# Altium schematic sheet processingModule.SchDoc
size C; SheetNumber: 1; SheetTotal: 1
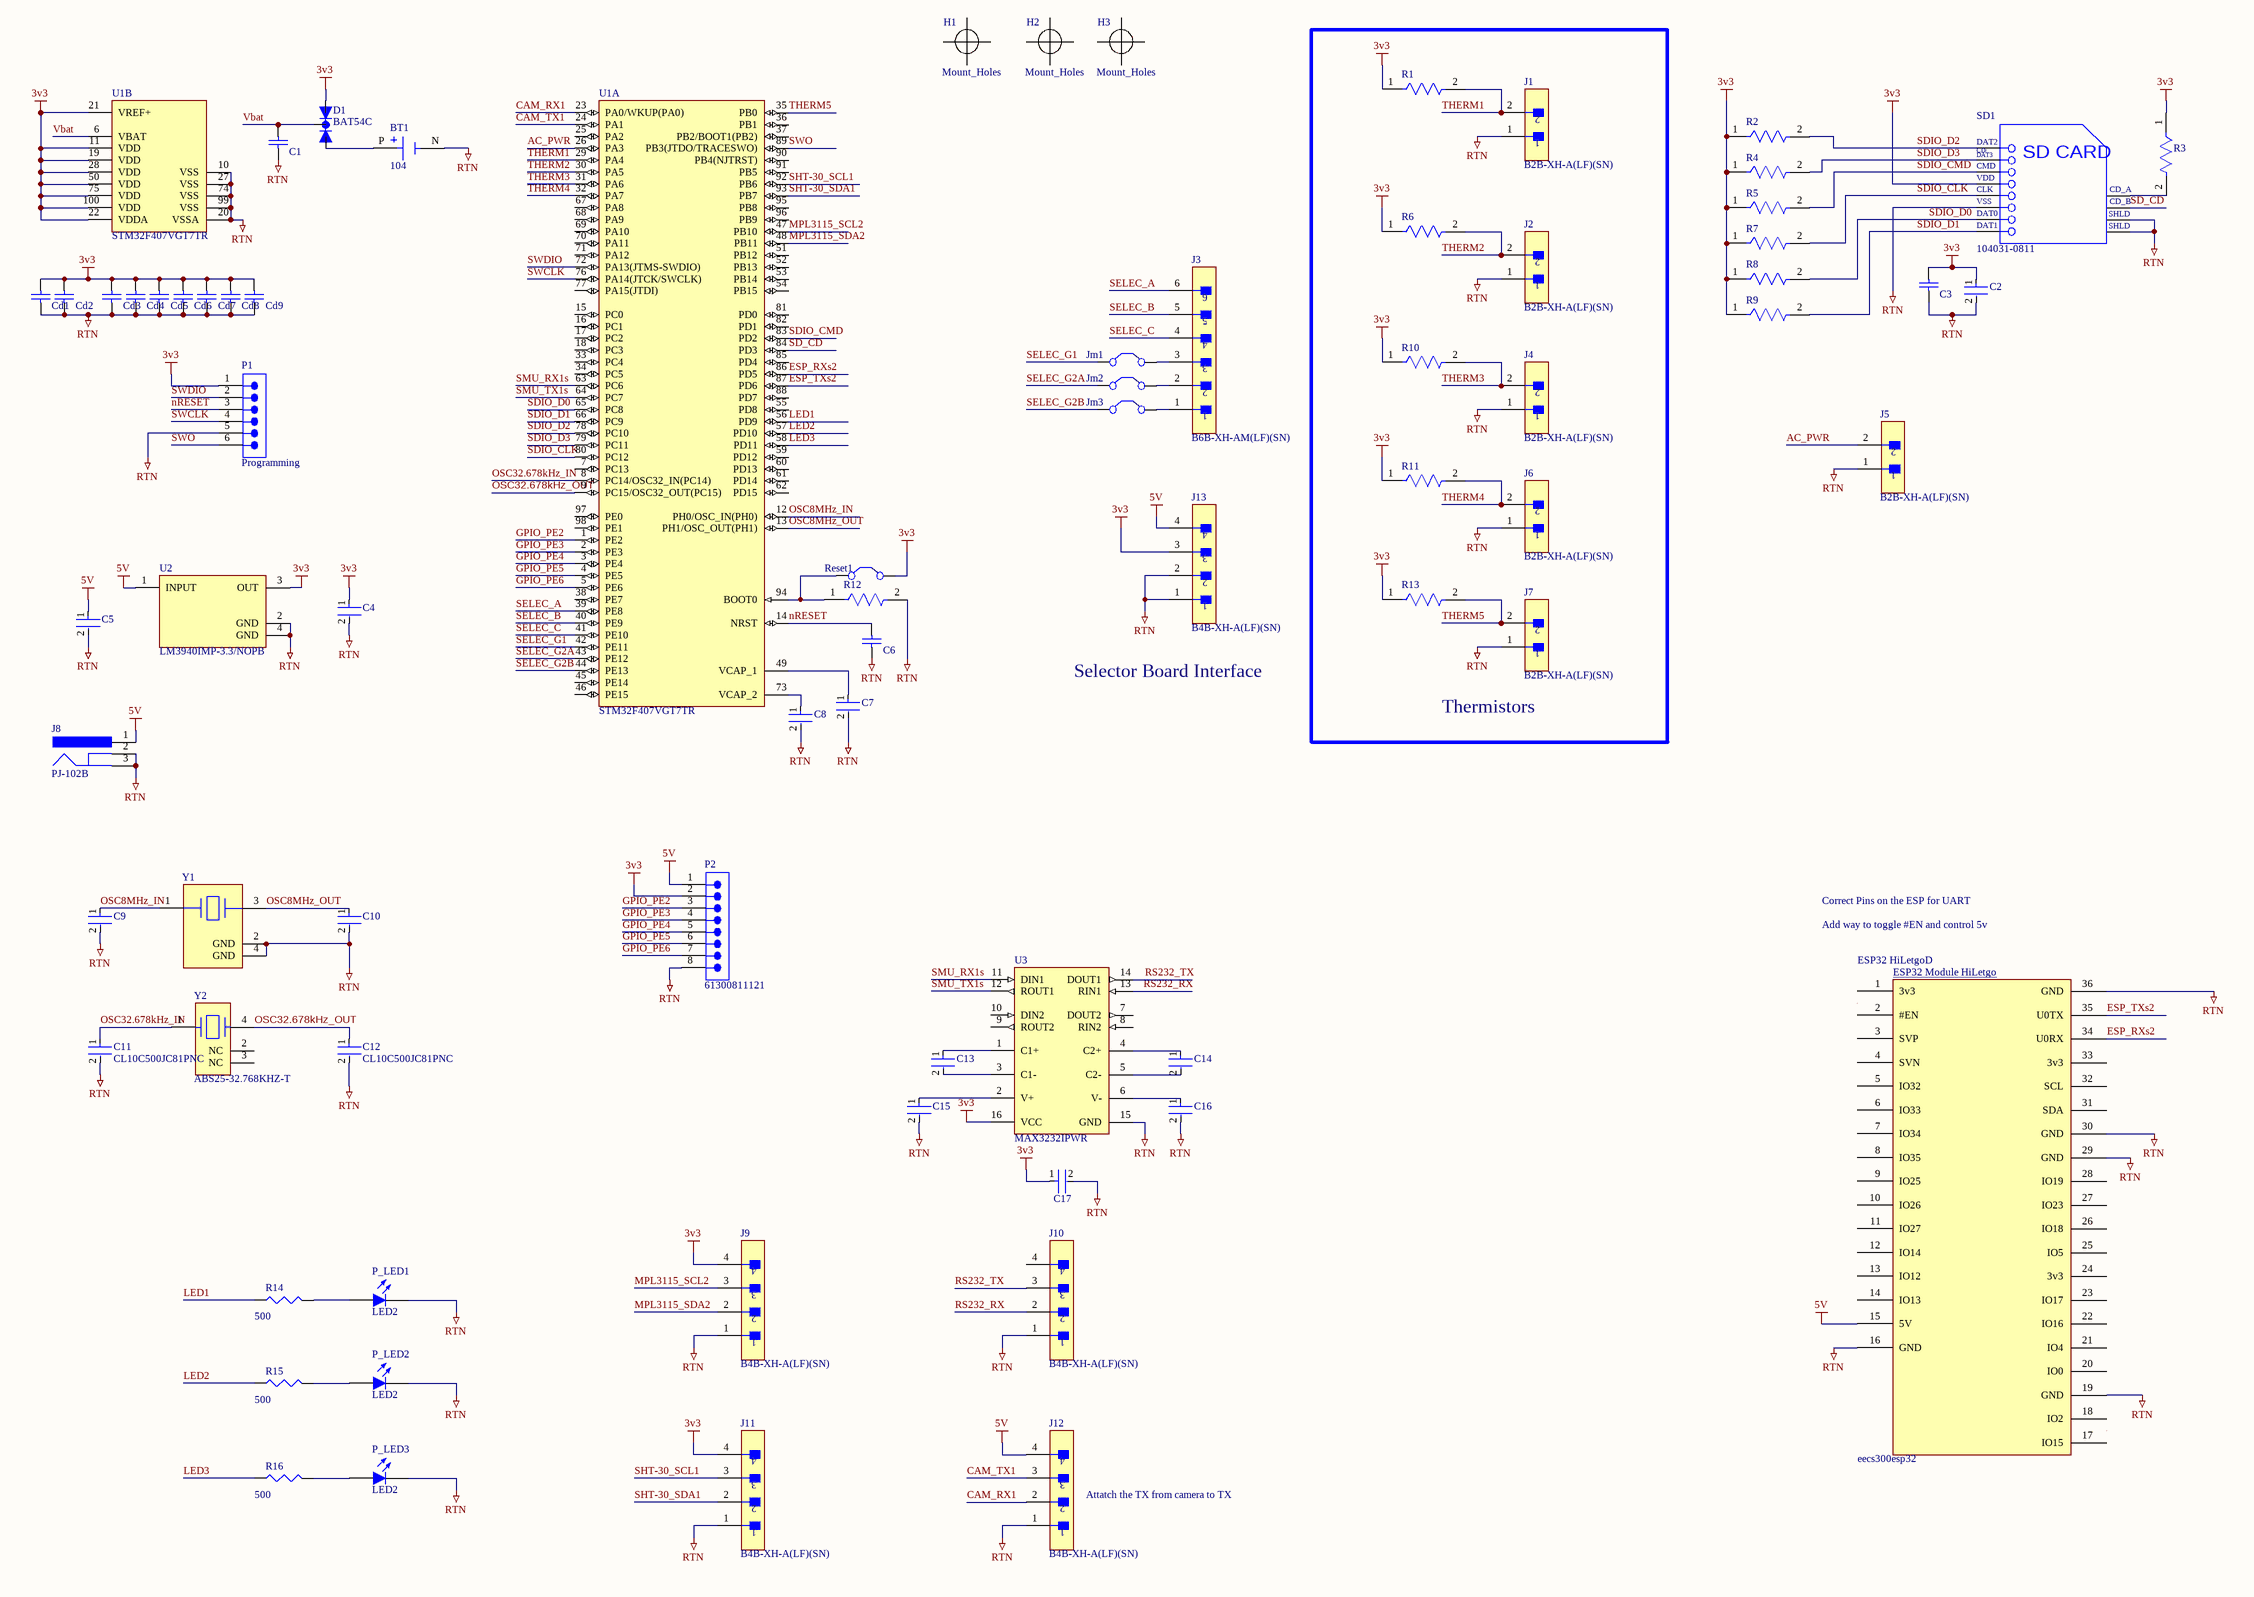
[diagram p0: processingModule.SchDoc]

## Parts
BT1  104  [BAT_104]
C1  CAP 10uF 10V 0603(1608)  [CAPC0603(1608)100_N]  (value not drawn)
C2  C0603X104K5RACTU  [FP-C0603-CJ-MFG]  (value not drawn)
C3  CAP 10uF 10V 0603(1608)  [CAPC0603(1608)100_N]  (value not drawn)
C4  C2012X5R1A336M125AC  [FP-C2012-125-0_2-IPC_A]  (value not drawn)
C5  GRM188R71C474KA88D  [FP-GRM188-0_1-e0_2_0_5-IPC_A]  (value not drawn)
C6  CAP 100nF 16V 0603(1608)  [CAPC0603(1608)100_N]  (value not drawn)
C7  C0603C225K4PACTU  [FP-C0603C225K4PACTU-MFG]  (value not drawn)
C8  C0603C225K4PACTU  [FP-C0603C225K4PACTU-MFG]  (value not drawn)
C9  C0603C200J5GACTU  [FP-C0603C-CF-MFG]  (value not drawn)
C10  C0603C200J5GACTU  [FP-C0603C-CF-MFG]  (value not drawn)
C11  CL10C500JC81PNC  [FP-CL10-IPC_B]
C12  CL10C500JC81PNC  [FP-CL10-IPC_B]
C13  C0603X104K5RACTU  [FP-C0603-CJ-MFG]  (value not drawn)
C14  C0603X104K5RACTU  [FP-C0603-CJ-MFG]  (value not drawn)
C15  C0603X104K5RACTU  [FP-C0603-CJ-MFG]  (value not drawn)
C16  C0603X104K5RACTU  [FP-C0603-CJ-MFG]  (value not drawn)
C17  C0603X104K5RACTU  [FP-C0603-CJ-MFG]  (value not drawn)
Cd1  CAP 10uF 10V 0603(1608)  [CAPC0603(1608)100_N]  (value not drawn)
Cd2  CAP 10uF 10V 0603(1608)  [CAPC0603(1608)100_N]  (value not drawn)
Cd3  CAP 100nF 16V 0603(1608)  [CAPC0603(1608)100_N]  (value not drawn)
Cd4  CAP 100nF 16V 0603(1608)  [CAPC0603(1608)100_N]  (value not drawn)
Cd5  CAP 100nF 16V 0603(1608)  [CAPC0603(1608)100_N]  (value not drawn)
Cd6  CAP 100nF 16V 0603(1608)  [CAPC0603(1608)100_N]  (value not drawn)
Cd7  CAP 100nF 16V 0603(1608)  [CAPC0603(1608)100_N]  (value not drawn)
Cd8  CAP 100nF 16V 0603(1608)  [CAPC0603(1608)100_N]  (value not drawn)
Cd9  CAP 100nF 16V 0603(1608)  [CAPC0603(1608)100_N]  (value not drawn)
D1  BAT54C  [SOT23-R]
ESP32_HiLetgo  eecs300esp32  [eecs300esp32-Footprint-1]  (part D of 4)
H1  Mount_Holes  [MountHole-4-40PTH]
H2  Mount_Holes  [MountHole-4-40PTH]
H3  Mount_Holes  [MountHole-4-40PTH]
J1  B2B-XH-A(LF)(SN)  [FP-B2B-XH-A_LF_SN-MFG]
J2  B2B-XH-A(LF)(SN)  [FP-B2B-XH-A_LF_SN-MFG]
J3  B6B-XH-AM(LF)(SN)  [FP-B6B-XH-AM_LF_SN-MFG]
J4  B2B-XH-A(LF)(SN)  [FP-B2B-XH-A_LF_SN-MFG]
J5  B2B-XH-A(LF)(SN)  [FP-B2B-XH-A_LF_SN-MFG]
J6  B2B-XH-A(LF)(SN)  [FP-B2B-XH-A_LF_SN-MFG]
J7  B2B-XH-A(LF)(SN)  [FP-B2B-XH-A_LF_SN-MFG]
J8  PJ-102B  [CUI-PJ-102B_V]
J9  B4B-XH-A(LF)(SN)  [FP-B4B-XH-A_LF_SN-MFG]
J10  B4B-XH-A(LF)(SN)  [FP-B4B-XH-A_LF_SN-MFG]
J11  B4B-XH-A(LF)(SN)  [FP-B4B-XH-A_LF_SN-MFG]
J12  B4B-XH-A(LF)(SN)  [FP-B4B-XH-A_LF_SN-MFG]
J13  B4B-XH-A(LF)(SN)  [FP-B4B-XH-A_LF_SN-MFG]
Jm1  SolderJumper  [bridge]  (value not drawn)
Jm2  SolderJumper  [bridge]  (value not drawn)
Jm3  SolderJumper  [bridge]  (value not drawn)
P1  Programming  [61300611121]
P2  61300811121  [61300811121]
P_LED1  LED2  [LED0805]
P_LED2  LED2  [LED0805]
P_LED3  LED2  [LED0805]
R1  RC0603FR-0710KL  [FP-RC0603-0_55-IPC_C]  (value not drawn)
R2  RC0603FR-0747KL  [FP-RC0603FR-0747KL-MFG]  (value not drawn)
R3  RC0603FR-0747KL  [FP-RC0603FR-0747KL-MFG]  (value not drawn)
R4  RC0603FR-0747KL  [FP-RC0603FR-0747KL-MFG]  (value not drawn)
R5  RC0603FR-0747KL  [FP-RC0603FR-0747KL-MFG]  (value not drawn)
R6  RC0603FR-0710KL  [FP-RC0603-0_55-IPC_C]  (value not drawn)
R7  RC0603FR-0747KL  [FP-RC0603FR-0747KL-MFG]  (value not drawn)
R8  RC0603FR-0747KL  [FP-RC0603FR-0747KL-MFG]  (value not drawn)
R9  RC0603FR-0747KL  [FP-RC0603FR-0747KL-MFG]  (value not drawn)
R10  RC0603FR-0710KL  [FP-RC0603-0_55-IPC_C]  (value not drawn)
R11  RC0603FR-0710KL  [FP-RC0603-0_55-IPC_C]  (value not drawn)
R12  RC0603FR-0710KL  [FP-RC0603-0_55-IPC_C]  (value not drawn)
R13  RC0603FR-0710KL  [FP-RC0603-0_55-IPC_C]  (value not drawn)
R14  500  [J1-0603]
R15  500  [J1-0603]
R16  500  [J1-0603]
Reset1  SolderJumper  [bridge]  (value not drawn)
SD1  104031-0811  [MOLX-104031-0811_V]
U1  STM32F407VGT7TR  [STM-LQFP100_L]  (parts A,B of 2)
U2  LM3940IMP-3.3/NOPB  [FP-DCY0004A-MFG]
U3  MAX3232IPWR  [PW0016A_N]
Y1  ABM3B-8.000MHZ-10-D-1-G-T  [FP-ABM3B-MFG]  (value not drawn)
Y2  ABS25-32.768KHZ-T  [FP-ABS25-MFG]

## Blocks framed on the sheet
Thermistors: J1 J2 J4 J6 J7 R1 R6 R10 R11 R13

## Nets
3v3: C2.1 C3.2 C4.1 C17.1 Cd1.2 Cd2.2 Cd3.2 Cd4.2 Cd5.2 Cd6.2 Cd7.2 Cd8.2 Cd9.2 D1.2(A2) J9.4 J11.4 J13.3 P1.1 P2.2 R1.1 R2.1 R3.1 R4.1 R5.1 R6.1 R7.1 R8.1 R9.1 R10.1 R11.1 R13.1 Reset1.2(C2) SD1.4(VDD) U1.11(VDD) U1.19(VDD) U1.21(VREF+) U1.22(VDDA) U1.28(VDD) U1.50(VDD) U1.75(VDD) U1.100(VDD) U2.3(OUT) U3.16(VCC)
5V: C5.1 ESP32_HiLetgo.15(5V) J8.1 J12.4 J13.4 P2.1 U2.1(INPUT)
RTN: BT1.N(NEG) C1.1 C2.2 C3.1 C4.2 C5.2 C6.1 C7.2 C8.2 C9.2 C10.2 C11.2 C12.2 C15.2 C16.2 C17.2 Cd1.1 Cd2.1 Cd3.1 Cd4.1 Cd5.1 Cd6.1 Cd7.1 Cd8.1 Cd9.1 ESP32_HiLetgo.16(GND) ESP32_HiLetgo.19(GND) ESP32_HiLetgo.29(GND) ESP32_HiLetgo.30(GND) ESP32_HiLetgo.36(GND) J1.1 J2.1 J4.1 J5.1 J6.1 J7.1 J8.2 J8.3 J9.1 J10.1 J11.1 J12.1 J13.1 J13.2 P1.5 P2.8 P_LED1.2(K) P_LED2.2(K) P_LED3.2(K) R12.2 SD1.6(VSS2) SD1.11(SHLD1) SD1.12(SHLD2) U1.10(VSS) U1.20(VSSA) U1.27(VSS) U1.74(VSS) U1.99(VSS) U2.2(GND) U2.4(GND) U3.15(GND) Y1.2(GND) Y1.4(GND)
AC_PWR: J5.2 U1.26(PA3)
CAM_RX1: J12.2 U1.23(PA0/WKUP(PA0))
CAM_TX1: J12.3 U1.24(PA1)
ESP_RXs2: ESP32_HiLetgo.34(U0RX) U1.86(PD5)
ESP_TXs2: ESP32_HiLetgo.35(U0TX) U1.87(PD6)
GPIO_PE2: P2.3 U1.1(PE2)
GPIO_PE3: P2.4 U1.2(PE3)
GPIO_PE4: P2.5 U1.3(PE4)
GPIO_PE5: P2.6 U1.4(PE5)
GPIO_PE6: P2.7 U1.5(PE6)
LED1: R14.1 U1.56(PD9)
LED2: R15.1 U1.57(PD10)
LED3: R16.1 U1.58(PD11)
MPL3115_SCL2: J9.3 U1.47(PB10)
MPL3115_SDA2: J9.2 U1.48(PB11)
nRESET: C6.2 P1.3 U1.14(NRST)
OSC8MHz_IN: C9.1 U1.12(PH0/OSC_IN(PH0)) Y1.1
OSC8MHz_OUT: C10.1 U1.13(PH1/OSC_OUT(PH1)) Y1.3
OSC32.678kHz_IN: C11.1 U1.8(PC14/OSC32_IN(PC14)) Y2.1
OSC32.678kHz_OUT: C12.1 U1.9(PC15/OSC32_OUT(PC15)) Y2.4
RS232_RX: J10.2 U3.13(RIN1)
RS232_TX: J10.3 U3.14(DOUT1)
SD_CD: SD1.10(CD_B) U1.84(PD3)
SDIO_CLK: R7.2 SD1.5(CLK) U1.80(PC12)
SDIO_CMD: R5.2 SD1.3(VSS1) U1.83(PD2)
SDIO_D0: R8.2 SD1.7(DAT0) U1.65(PC8)
SDIO_D1: R9.2 SD1.8(DAT1) U1.66(PC9)
SDIO_D2: R2.2 SD1.1(CD/DAT3) U1.78(PC10)
SDIO_D3: R4.2 SD1.2(CMD) U1.79(PC11)
SELEC_A: J3.6 U1.39(PE8)
SELEC_B: J3.5 U1.40(PE9)
SELEC_C: J3.4 U1.41(PE10)
SELEC_G1: Jm1.1(C1) U1.42(PE11)
SELEC_G2A: Jm2.1(C1) U1.43(PE12)
SELEC_G2B: Jm3.1(C1) U1.44(PE13)
SHT-30_SCL1: J11.3 U1.92(PB6)
SHT-30_SDA1: J11.2 U1.93(PB7)
SMU_RX1s: U1.63(PC6) U3.11(DIN1)
SMU_TX1s: U1.64(PC7) U3.12(ROUT1)
SWCLK: P1.4 U1.76(PA14(JTCK/SWCLK))
SWDIO: P1.2 U1.72(PA13(JTMS-SWDIO))
SWO: P1.6 U1.89(PB3(JTDO/TRACESWO))
THERM1: J1.2 R1.2 U1.29(PA4)
THERM2: J2.2 R6.2 U1.30(PA5)
THERM3: J4.2 R10.2 U1.31(PA6)
THERM4: J6.2 R11.2 U1.32(PA7)
THERM5: J7.2 R13.2 U1.35(PB0)
Vbat: C1.2 D1.3(C) U1.6(VBAT)
NetBT1_P: BT1.P(POS) D1.1(A1)
NetC7_1: C7.1 U1.49(VCAP_1)
NetC8_1: C8.1 U1.73(VCAP_2)
NetC13_1: C13.1 U3.1(C1+)
NetC13_2: C13.2 U3.3(C1-)
NetC14_1: C14.1 U3.4(C2+)
NetC14_2: C14.2 U3.5(C2-)
NetC15_1: C15.1 U3.2(V+)
NetC16_1: C16.1 U3.6(V-)
NetJ3_1: J3.1 Jm3.2(C2)
NetJ3_2: J3.2 Jm2.2(C2)
NetJ3_3: J3.3 Jm1.2(C2)
NetP_LED1_1: P_LED1.1(A) R14.2
NetP_LED2_1: P_LED2.1(A) R15.2
NetP_LED3_1: P_LED3.1(A) R16.2
NetR3_2: R3.2 SD1.9(CD_A)
NetR12_1: R12.1 Reset1.1(C1) U1.94(BOOT0)

Not connected (* = marked no-connect by the designer): ESP32_HiLetgo 1(3v3) 2(#EN) 3(SVP) 4(SVN) 5(IO32) 6(IO33) 7(IO34) 8(IO35) 9(IO25) 10(IO26) 11(IO27) 12(IO14) 13(IO12) 14(IO13) 17(IO15) 18(IO2) 20(IO0) 21(IO4) 22(IO16) 23(IO17) 24(3v3) 25(IO5) 26(IO18) 27(IO23) 28(IO19) 31(SDA) 32(SCL) 33(3v3); H1 0; H2 0; H3 0; J10 4; U1 7(PC13) 15(PC0) 16(PC1) 17(PC2) 18(PC3) 25(PA2) 33(PC4) 34(PC5) 36(PB1) 37(PB2/BOOT1(PB2)) 38(PE7) 45(PE14) 46(PE15) 51(PB12) 52(PB13) 53(PB14) 54(PB15) 55(PD8) 59(PD12) 60(PD13) 61(PD14) 62(PD15) 67(PA8) 68(PA9) 69(PA10) 70(PA11) 71(PA12) 77(PA15(JTDI)) 81(PD0) 82(PD1) 85(PD4) 88(PD7) 90(PB4(NJTRST)) 91(PB5) 95(PB8) 96(PB9) 97(PE0) 98(PE1); U3 7(DOUT2) 8(RIN2) 9(ROUT2) 10(DIN2); Y2 2(NC) 3(NC)

## Notes on the sheet
- Selector Board Interface
- Correct Pins on the ESP for UART
- Add way to toggle #EN and control 5v
- (near J12) Attatch the TX from camera to TX
- (in symbol CMP-001-0002-3, part D) ESP32 Module HiLetgo
- (in symbol CMP-2000-05825-1) DAT2; CD/; DAT3; SD CARD; VSS; SHLD

## Library data of the parts
C1 C3 Cd1 Cd2 = CMP-1035-02799-1: CAP 10uF 10V ±10% 0603 (1608 Metric) Thickness 1mm SMD; Case-Metric: 1608; Case-EIA: 0603; Max Thickness: 1 mm; Tolerance: ±10%; Technology: SMT; Rated Voltage: 10 V; Value: 10uF
C2 C13-C17 = CMP-2006-03300-2: CAP CER 0.1UF 50V X7R 0603; Manufacturer: Kemet; Capacitance: 100nF; Material: Ceramic; Tolerance: 10%; Value: 100nF; Temperature Coefficient: 15%; Temperature Range High: +125°C; Temperature Range Low: -55°C; Manufacturer Part Number: C0603X104K5RACTU; Voltage: 50V; ComponentLink2Description: Datasheet; RoHS: TRUE; ComponentLink2URL: https://content.kemet.com/datasheets/KEM_C1013_X7R_FT-CAP_SMD.pdf; Device Class L3: Ceramic Capacitors; Device Class L2: Capacitors; Package: C0603-CJ; Height: 0.95mm; Device Class L1: Passive Components; Temperature Characteristic: X7R; Lead Free: Yes; Digikey Description: CAP CER 0.1UF 50V X7R 0603; Automotive: No; Mouser Description: Capacitor; Ceramic; Cap 0.1uF; Tol+10%; SMT; Flexible Termination; Vol-Rtg 50V; TR; Temperature: -55°C to +125°C; Octopart: https://octopart.com/c0603x104k5ractu-kemet-9145062; Category: Cap; Voltage Rating: 50V; Ipc Land Pattern Name: CAPC16080X80
C4 = CMP-08246-002720-1: Multilayer Ceramic Capacitors 33μF ±20% 10V X5R SMD 0805; Capacitance: 33uF; Dielectric: X5R; Series: C; Packaging: Tape and Reel; Voltage Rating: 10V; Height: 1.25mm; Tolerance: 20%; Thickness: 0.057inch; Min Operating Temperature: -55°C; Max Operating Temperature: 85°C; Case Code (Imperial): 0805; Voltage Rating (DC): 10V; Case Code (Metric): 2012; Length: 2mm; REACH SVHC: No SVHC; Depth: 1.25mm; Package Quantity: 1; Dielectric Material: Ceramic; Lead Free: Lead Free; Case/Package: 0805; Termination: SMD/SMT; Resistor Type: Ceramic; RoHS Compliant: Yes; Width: 0.049inch; Weight: 0.000194oz; Mount: Surface Mount
C5 = CMP-2006-02860-2: Chip Multilayer Ceramic Capacitors for General Purpose, 0603, 0.47uF, X7R, 15%, 10%, 16V; Capacitance: 470nF; Material: Ceramic; Termination: SMD/SMT; Case Code (Imperial): 0603; Height: 0.8mm; Dielectric: X7R; Length: 1.6mm; Packaging: Tape and Reel; Mount: Surface Mount; Thickness: 0.035inch; Voltage Rating (DC): 16V; Case Code (Metric): 1608; REACH SVHC: No SVHC; Depth: 0.8mm; Number of Pins: 2; Max Operating Temperature: 125°C; Min Operating Temperature: -55°C; Width: 0.8mm; Voltage: 16V; Lead Free: Lead Free; Voltage Rating: 16V; Package Quantity: 1; Case/Package: 0603; Tolerance: 10%
C6 Cd3-Cd9 = CMP-1035-02583-1: CAP 100nF 16V ±5% 0603 (1608 Metric) Thickness 1mm SMD; Case-Metric: 1608; Case-EIA: 0603; Tolerance: ±5%; Rated Voltage: 16 V; Max Thickness: 1 mm; Technology: SMT; Value: 100nF
C7 C8 = CMP-2006-02259-2: CAP CER 2.2UF 16V X5R 0603; Dielectric Material: Ceramic; Tolerance: 10%; Dissipation Factor: 5%; Series: C; Voltage Rating (DC): 16V; REACH SVHC: No SVHC; RoHS Compliant: Yes; Number of Pins: 2; Max Operating Temperature: 85°C; Voltage Rating: 16V; Min Operating Temperature: -55°C; Termination: SMD/SMT; Dielectric: X5R; Packaging: Tape and Reel; Contact Plating: Tin; Case Code (Metric): 1608; Height: 0.8mm; Capacitance: 2.2uF; Case/Package: 0603; Width: 0.8mm; Construction: Flat; Depth: 0.8mm; Thickness: 0.034inch; Radiation Hardening: No; Length: 1.6mm; Mount: Surface Mount; Case Code (Imperial): 0603; Voltage: 16V; Package Quantity: 1; Lead Free: Lead Free
C9 C10 = CMP-1035-00783-3: CAP CER 20PF 50V 5% NP0 0603; Manufacturer: KEMET; Temperature Coefficient: 30ppm/°C; Temperature Characteristic: C0G; Automotive Grade: Grade 1; Tolerance: 0.05; Material: Ceramic; Category: Cap; Manufacturer Part Number: C0603C200J5GACTU; Temperature Range Low: -55°C; RoHS: TRUE; ComponentLink2URL: https://api.kemet.com/component-edge/download/datasheet/C0603C100J5GACAUTO.pdf; Package: C0603C-CF; Height: 0.87mm; Capacitance: 20 pF; Voltage Rating: 50 V; Octopart: https://octopart.com/c0603c200j5gactu-kemet-9138585; Device Class L1: Passive Components; Automotive: Yes; Digikey Description: CAP CER 20PF 50V 5% NP0 0603; Temperature Range High: +125°C; Device Class L3: Ceramic Capacitors; Mouser Description: Multilayer Ceramic Capacitors MLCC - SMD/SMT 50volts 20pF C0G 5%; ComponentLink2Description: Datasheet; Device Class L2: Capacitors; Lead Free: Yes; Temperature: -55°C to +125°C; Value: 20 pF
C11 C12 = CMP-13271-000864-1: Cap Ceramic 50pF 100V C0G ±5% Pad SMD 0603 +125°C T/R; Length: 0.063inch; Case/Package: 0603; Packaging: Tape and Reel; Thickness: 0.035inch; Width: 0.031inch; Tolerance: 5%; Capacitance: 50pF; Ratings: AEC-Q200; Case Code (Imperial): 0603; Max Operating Temperature: 125°C; Mount: Surface Mount; Case Code (Metric): 1608; Min Operating Temperature: -55°C; Voltage Rating: 100V
D1 = BAT54C: DIODE, SCHOTTKY, DUAL; Diode Type:Schottky; Voltage, Vrrm:30V; Current, If AV:300mA; Current, Ifsm:1A; Voltage, Vf Max:0.4V; Max Junction Temperature, Tj:150Â°C; Termination Type:SMD; Case Style:SOT-23; No. of Pins:3; Current, If ;RoHS Compliant: Yes; MF: ON Semiconductor; Check_prices: https://www.snapeda.com/parts/BAT54C/Onsemi/view-part/?ref=eda; Value: *; Availability: In Stock; MP: BAT54C; Price: None; Package: SOT-23-3 ON Semiconductor; SnapEDA_Link: https://www.snapeda.com/parts/BAT54C/Onsemi/view-part/?ref=snap; Purchase-URL: https://pricing.snapeda.com/search/part/BAT54C/?ref=eda
ESP32_HiLetgo = CMP-001-0002-3: HiLetgo ESP32 knock off
J1 J2 J4-J7 = CMP-2000-05888-3: CONN HEADER VERT 2POS 2.5MM; Current Rating: 3A; Voltage Rating: 250V; Number of Contacts: 2; Contact Resistance: 20mR; Wire/Cable Gauge: 22AWG; Insulation Resistance: 1GR; Connector Type: Male Pin; Packaging: Bulk; Contact Material: Brass; Lead Free: Lead Free; Orientation: Straight; Contact Plating: Tin; Max Current Rating: 3A; Termination: Solder; Fastening Type: Detent; Depth: 5.75mm; Housing Material: Polyamide; REACH SVHC: No SVHC; Series: XH; Voltage Rating (AC): 250V; Number of Positions: 2; Color: Natural; Contact Type: Male Pin; Max Voltage Rating (DC): 250V; Pitch: 2.5mm; Lead Pitch: 2.5mm; Mount: Through Hole; Max Operating Temperature: 85°C; Length: 7.4mm; Max Voltage Rating (AC): 250V; Min Operating Temperature: -25°C; Number of Rows: 1; Housing Color: White
J3 = CMP-17439-000167-1: CONN HEADER VERT 6POS 2.5MM; Shape: Straight; Current Rating: 3A; Mated Stacking Heights: 9.8mm; Number of Positions: 6; Voltage Rating: 250V; Pitch: 2.5mm; Insulation Color: Natural; Number of Pins: 6; Width: 5.75mm; Flammability Rating: UL94 V-0; Packaging: Bulk; Connector Type: Header; Number of Rows: 1; Contact Plating: Copper; Mount: Through Hole; Min Operating Temperature: -25°C; Contact Type: Male Pin; Contact Shape: Square; Fastening Type: Detent; Length: 17.4mm; Series: XH; Contact Finish - Mating: TIN; Max Operating Temperature: 85°C; Insulation Material: Nylon; Number of Poles: 6; Termination: Press-Fit; Contact Material: Brass; Height: 7mm
J8 = CMP-2000-06900-1: Through Hole Right Angle DC Power Jack, 2.5 A, 2.5 mm Center Pin, 3 Position, -25 to 85 degC, RoHS, Bulk; Manufacturer: CUIInc.; Insulation Resistance: 100MOhms; Inside Contact Diameter: 2.5mm; Outside Contact Diameter: 6.5mm; Voltage Rating: 24V; Current Rating: 2.5A; Brand: CUI; Datasheet URL: http://www.cui.com/product/resource/pj-102b.pdf; Housing Material: PolybutyleneTerephthalate(PBT); Operating Temperature Range: -25Cto+85C; Package Reference: PJ-102B; Factory Pack Quantity: 280; RoHS: True; Contact Material: Copper; Datasheet Version: Rev. 1.03, 04/2016; Product: Jacks; Mounting Angle: Right; Mounting Style: ThroughHole; Flammability Rating: UL94V-0; Product Category: DCPowerConnectors; Contact Gender: Male; Termination Style: ThroughHole; Manufacturer URL: http://www.cui.com/; Mounting Technology: ThroughHole; Package Description: 3-Pin Through Hole Device, Body 14.4 x 9 mm, Height 11 mm; Contact Plating: Nickel; Packaging: Bulk; Connector Type: DCPowerJack
J9-J13 = CMP-17439-000250-1: CONN HEADER VERT 4POS 2.5MM; Number of Contacts: 4; Contact Resistance: 20mR; Voltage Rating: 250V; Max Current Rating: 3A; Gender: Male; Wire/Cable Gauge: 22AWG; Mated Stacking Heights: 9.8mm; Insulation Resistance: 1GR; Orientation: Straight; Contact Type: Male Pin; Contact Finish - Mating: TIN; Series: XH; Max Voltage Rating (AC): 250V; Lead Pitch: 2.5mm; Contact Shape: Square; Insulation Color: Natural; Termination: Solder; Lead Free: Lead Free; Voltage Rating (AC): 250V; Number of Rows: 1; Flammability Rating: UL94 V-0; Number of Positions: 4; Max Operating Temperature: 85°C; Package Quantity: 500; Mount: Through Hole; REACH SVHC: No SVHC; Connector Type: Header; Insulation Material: Nylon; Fastening Type: Detent; Min Operating Temperature: -25°C; Housing Color: White; Packaging: Bulk; Contact Plating: Tin; Contact Material: Brass; Max Voltage Rating (DC): 250V; Housing Material: Polyamide; Color: Natural; Material: Polyamide; Pitch: 2.5mm; Depth: 5.75mm; Current Rating: 3A; Length: 12.4mm
Jm1-Jm3 Reset1 = SolderJumper: Solder Configuration Jumper; Published: 24-Mar-1999; LatestRevisionDate: 17-Jul-2002; LatestRevisionNote: Re-released for DXP Platform.; PackageReference: RAD-0.2; Publisher: Altium Limited; PackageDescription: Radial Cap, Thru-Hole; 2 Leads; 0.2 in Pin Spacing
P1 = CMP-1502-01070-2: NexarPartId: 20084590; Operating Supply Voltage: 250V; Current Rating: 3A; Number of Contacts: 6; Gender: Male; Connector Type: Male Pin; Pitch: 2.54mm; Contact Resistance: 20mΩ; Lead Free: Lead Free; REACH SVHC: Unknown; Number of Rows: 1; Color: Black; Min Operating Temperature: -40°C; Contact Material: Copper; Lead Pitch: 2.54mm; Contact Plating: Gold; Number of Pins: 6; Height: 8.89mm; Orientation: Vertical; Termination: Through Hole; Mount: Through Hole; RoHS: Compliant; Contact Gender: Male; Contact Mating Length: 5.9944mm; Voltage Rating: 250V; Number of Positions: 6; Housing Material: PBT; Packaging: Bulk; Max Operating Temperature: 105°C
P2 = CMP-1502-01076-2: NexarPartId: 32855533; Current Rating: 3A; Connector Type: Male Pin; Voltage Rating: 250V; Number of Contacts: 8; Pitch: 2.54mm; Contact Resistance: 20mΩ; Gender: Male; REACH SVHC: Unknown; Number of Rows: 1; Mount: Through Hole; Termination: Solder; Number of Pins: 8; Number of Positions: 8; Height: 8.54mm; Contact Mating Length: 5.9944mm; Orientation: Vertical; Operating Supply Voltage: 250V; Min Operating Temperature: -40°C; Max Operating Temperature: 105°C; Packaging: Bulk; Color: Black; Lead Pitch: 2.54mm; RoHS: Compliant; Contact Material: Copper; Contact Plating: Gold
P_LED1-P_LED3 = CMP-006-0052-1: Typical RED, GREEN, YELLOW, AMBER GaAs LED; Source: SolarCar.SchLib; Design Item ID: LED2; LatestRevisionNote: Re-released for DXP Platform.; PackageVersion: Feb-2002; Component Type: Standard; Pin Count: 2; PackageDescription: SM LED; 2 Flat Leads; Publisher: Altium Limited; Published: 8-Jun-2000; LatestRevisionDate: 17-Jul-2002; PackageReference: 3.2X1.6X1.1
R1 R6 R10-R13 = CMP-2100-03664-2: RES 10K OHM 1% 1/10W 0603; Voltage Rating: 75V; Voltage Rating (DC): 50V; Resistance: 10kR; Power Rating: 100mW; Temperature Coefficient: 100ppm/°C; Depth: 0.8mm; Termination: SMD/SMT; Resistor Type: Thick Film; Series: RC; Construction: Rectangular; Features: Moisture Resistant; Packaging: Tape and Reel; Min Operating Temperature: -55°C; Number of Terminations: 2; Lead Pitch: 0.3mm; RoHS Compliant: Yes; Case/Package: 0603; Resistance Tolerance: 1%; Military Standard: Not; Weight: 7.1E-05oz; Number of Pins: 2; Tolerance: 1%; Length: 1.6mm; Case Code (Imperial): 0603; Lead Free: Lead Free; Width: 0.8mm; Max Power Dissipation: 100mW; Height: 0.45mm; Max Operating Temperature: 155°C; Case Code (Metric): 1608; Size Code: 0603
R2-R5 R7-R9 = CMP-1659-00055-2: RES SMD 47K OHM 1% 1/10W 0603; Voltage Rating: 50V; Temperature Coefficient: 100ppm/°C; Max Power Dissipation: 100mW; Resistance: 47kR; Voltage Rating (DC): 50V; Min Operating Temperature: -55°C; Packaging: Tape and Reel; Features: Moisture Resistant; Termination: SMD/SMT; Technology: THICK FILM; Lead Free: Lead Free; Max Operating Temperature: 155°C; Width: 0.031inch; Case Code (Metric): 1608; Tolerance: 1%; Package Quantity: 1; Resistor Type: Thick Film; RoHS Compliant: Yes; Case/Package: 0603; Case Code (Imperial): 0603; Resistance Tolerance: 1%; Length: 0.063inch; Series: RC; Number of Pins: 2; Power Rating: 100mW; Number of Terminations: 2; Construction: Rectangular; Height: 0.022inch; Military Standard: Not; Size Code: 0603; Depth: 0.8mm
R14-R16 = Res3: Resistor; Value: 10K; Published: 8-Jun-2000; LatestRevisionDate: 29-May-2009; LatestRevisionNote: IPC-7351 Footprint Added.; PackageReference: J1-0603; Publisher: Altium Limited; PackageDescription: Chip Resistor
SD1 = CMP-2000-05825-1: Micro SD Card, RA, -25 to 85 degC, 8-Pin SMD, RoHS, Tape and Reel; Voltage Rating: 10VAC/DC; Number of Contacts: 8; Insertion - Extraction Style: Push-Pull; Pitch: 1.1mm; Mating Cycles: 10000; Brand: Molex; Current Rating: 500mA; Manufacturer URL: http://www.molex.com/; Card Type: microSD; Mounting Type: Standard; Height: 1.42mm; Mounting Technology: SurfaceMount; Contact Plating: Gold; Product Category: MemoryCardConnectors; Package Description: 8-Pin Surface Mount Device, Body 11.95 x 11.4 mm, Pitch 1.1 mm; Datasheet URL: http://www.molex.com/pdm_docs/sd/1040310811_sd.pdf; Termination Style: SMD; Length: 11.4mm; Housing Material: LiquidCrystalPolymer(LCP); Orientation: RightAngle; RoHS: True; Contact Material: PhosphorBronze; Datasheet Version: Rev. E, 04/2006; Packaging: Reel; Manufacturer: Molex; Series: 104031; Product: CardConnectors; Number of Rows: 1Row; Package Reference: 104031-0811
U1 = CMP-0243-00163-1: ARM Cortex-M4 32-bit MCU+FPU, 1024 KB Flash, 192 KB Internal RAM, 82 I/Os, 100-Pin LQFP, -40 to 105 degC, Tape and Reel; Internal RAM Size (kB): 192; FLASH Size (Prog) (kB): 1024; D/A Converter: 2; Supply Voltage(Vcc) min (V): 1.8; I/Os (High Current): 82; Operating Frequency(F) (Processor speed) (MHz): 168; DatasheetVersion: Rev. 6; ComponentLink2URL: http://www.st.com/st-web-ui/static/active/en/resource/technical/document/datasheet/DM00037051.pdf; ComponentLink1URL: http://www.st.com/; Packing: Tape and Reel; Mounting Technology: Surface Mount; ComponentLink2Description: Datasheet; Core: ARM Cortex-M4; Package Description: LQFP100; Package Reference: 100-Pin Low Profile Quad Flat Package, Body 14 x 14 mm, Pitch 0.5 mm; ComponentLink1Description: Manufacturer URL
U2 = CMP-0062-01788-4: IC REG LINEAR 3.3V 1A SOT223-4; Min Input Voltage: 4.5V; Max Supply Voltage: 7.5V; Number of Outputs: 1; Output Type: Fixed; Polarity: Positive; Dropout Voltage: 500mV; Quiescent Current: 15mA; Max Output Voltage: 3.3V; Length: 6.5mm; Termination: SMD/SMT; Width: 3.56mm; Min Supply Voltage: 4.5V; Max Output Current: 1A; Case/Package: SOT-223; Output Voltage: 3.3V; Current Rating: 1A; Packaging: Tape and Reel; Lead Free: Lead Free; Nominal Output Voltage: 3.3V; Height: 1.6mm; Series: -; Output Configuration: Positive; Radiation Hardening: No; Number of Regulators: 1; Package Quantity: 1000; REACH SVHC: No SVHC; Max Input Voltage: 7.5V; Max Operating Temperature: 125°C; Min Operating Temperature: -40°C; Output Current: 1A; Contact Plating: Tin; Number of Pins: 4; Mount: Surface Mount
U3 = CMP-0299-01749-2: 3-V to 5.5-V Multichannel RS-232 Line Driver / Receiver with ±15-kV ESD Protection, -40 to 85 degC, 16-Pin TSSOP (PW), Green (RoHS & no Sb/Br); ICC(Max)(mA): 1; Drivers Per Package: 2; Supply Voltage(s)(V): 3.3 or 5.0; ESD HBM(kV): +/-15; RS-232: TRUE; ComponentLink3URL: http://www.ti.com/litv/pdf/mpds361; PackageReference: PW0016A; ComponentLink1Description: Manufacturer URL; DatasheetVersion: SLLS410I; ComponentLink3Description: Package Specification; ComponentLink2Description: Datasheet; PackageVersion: revG, Feb-2011; Receivers Per Package: 2; SubFamily: RS-232; ComponentLink1URL: www.ti.com; Single Supply: TRUE; ComponentLink2URL: http://www.ti.com/general/docs/lit/getliterature.tsp?genericPartNumber=MAX3232&fileType=pdf; PackageDescription: 16-Pin Plastic Thin Small Outline Package 5 x 4.4 mm Body ,0.65 mm Pitch
Y1 = CMP-27762-007005-1: Crystal 8MHz ±10ppm 10pF SMD-4 5mm x 3.2mm; Frequency Stability: 35ppm; ESR (Equivalent Series Resistance): 200R; Width: 0.126inch; Length: 0.197inch; Min Operating Temperature: -40°C; Mount: Surface Mount; Frequency Tolerance: 10ppm; RoHS Compliant: Yes; Lead Free: Lead Free; Frequency: 8MHz; Max Operating Temperature: 85°C; Packaging: Tape and Reel; Case/Package: SMD/SMT; Height: 0.043inch; Load Capacitance: 10pF
Y2 = CMP-2000-05037-2: CRYSTAL 32.7680KHZ 12.5PF SMD; ESR (Equivalent Series Resistance): 50kR; Tolerance: 20ppm; Width: 3.8mm; REACH SVHC: No SVHC; Load Capacitance: 12.5pF; Case/Package: SMD/SMT; Radiation Hardening: No; Series: ABS25; Number of Pins: 4; Mount: Surface Mount; RoHS Compliant: Yes; Packaging: Tape and Reel; Termination: SMD/SMT; Frequency Tolerance: 20ppm; Lead Free: Lead Free; Package Quantity: 1000; Min Operating Temperature: -40°C; Height: 0.098inch; Length: 8mm; Frequency: 32.768kHz; Max Operating Temperature: 85°C; Series Resistance: 50kR; Operating Frequency: 32.768 kHz; Depth: 3.8mm
BT1 = 104: Package: None; Price: None; MP: 104; Availability: Unavailable; Value: *